# Altium project Smart Fan Controller.PrjPcb
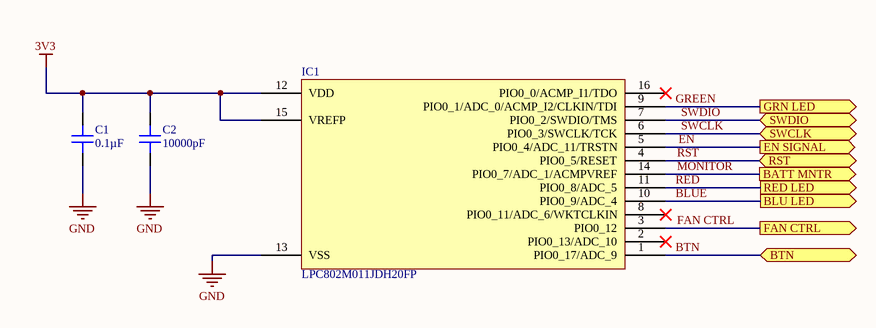
[diagram p0: SCH1_MCU.SchDoc]
5 sheets, 36 parts. Net scope: flat (ports and power ports of the same name join across sheets).
Board file: PCB_Smart_FAN_Controller_RevA.PcbDoc
Sheets:
  SCH1_MCU.SchDoc
  SCH2_Power.SchDoc
  SCH3_Fan_Control.SchDoc
  SCH4_RGB_Indicator.SchDoc
  SCH5_Misc.SchDoc

## Sheet SCH1_MCU.SchDoc: Airsoft FAN Controller
size A4

### Parts
C1  0.1µF  [CAP 0402_1005]
C2  10000pF  [CAP 0402_1005]
IC1  LPC802M011JDH20FP  [NXP TSSOP-16]

### Ports
BATT MNTR (out), BLU LED (out), BTN (bidir), EN SIGNAL (out), FAN CTRL (out), GRN LED (out), RED LED (out), RST (bidir), SWCLK (bidir), SWDIO (bidir)

### Nets
3V3: C1.2 C2.2 IC1.12(VDD) IC1.15(VREFP)
GND: C1.1 C2.1 IC1.13(VSS)
BLUE: IC1.10(PIO0_9/ADC_4) ; port BLU LED
BTN: IC1.1(PIO0_17/ADC_9) ; port BTN
EN: IC1.5(PIO0_4/ADC_11/TRSTN) ; port EN SIGNAL
FAN CTRL: IC1.3(PIO0_12) ; port FAN CTRL
GREEN: IC1.9(PIO0_1/ADC_0/ACMP_I2/CLKIN/TDI) ; port GRN LED
MONITOR: IC1.14(PIO0_7/ADC_1/ACMPVREF) ; port BATT MNTR
RED: IC1.11(PIO0_8/ADC_5) ; port RED LED
RST: IC1.4(PIO0_5/RESET) ; port RST
SWCLK: IC1.6(PIO0_3/SWCLK/TCK) ; port SWCLK
SWDIO: IC1.7(PIO0_2/SWDIO/TMS) ; port SWDIO

Not connected (* = marked no-connect by the designer): IC1 2(PIO0_13/ADC_10)* 8(PIO0_11/ADC_6/WKTCLKIN)* 16(PIO0_0/ACMP_I1/TDO)*

### Notes on the sheet
- Title
- Size:
- Date:
- A4
- Number:
- Time:
- Revision:
- Sheet
- of
- File:

### Library data of the parts
C1 = CC0402KRX5R8BB104: CAP CER 0.1UF 25V X5R 0402; Manufacturer: Yageo; Tolerance: ±10%; Part Number: CC0402KRX5R8BB104; Value: 0.1µF; Applications: General Purpose; Capacitance: 0.1µF; ComponentLink1Description: Datasheet; ComponentLink1URL: https://www.yageo.com/upload/media/product/productsearch/datasheet/mlcc/UPY-GPHC_X5R_4V-to-50V_25.pdf; ComponentLink2Description: DigiKey Link; ComponentLink2URL: http://digikey.com/product-detail/en/yageo/CC0402KRX5R8BB104/311-1697-1-ND/5195599; Device Package: 0402 (1005 Metric); LastUpdated: 9/2/2020 1:01:34 AM; Lifecycle Status: Active; Minimum Order: 1; Mounting Type: Surface Mount, MLCC; Operating Temperature: -55°C ~ 85°C; Package / Case: 0402 (1005 Metric); Packaging: TapeAndReel; PartId: 12727; Part Status: Active; Price: 0.01; Series: CC; Size / Dimension: 0.039" L x 0.020" W (1.00mm x 0.50mm); Supplier 1: DigiKey; Supplier Part Number 1: 311-1697-1-ND; Temperature Coefficient: X5R; Thickness (Max): 0.022" (0.55mm); Voltage - Rated: 25V
C2 = CGA2B2X5R1E103M050BA: CAP CER 10000PF 25V X5R 0402; Manufacturer: TDK Corporation; Tolerance: ±20%; Part Number: CGA2B2X5R1E103M050BA; Value: 10000pF; Applications: Automotive; Capacitance: 10000pF; ComponentLink1Description: Datasheet; ComponentLink1URL: https://product.tdk.com/info/en/catalog/datasheets/mlcc_automotive_general_en.pdf?ref_disty=digikey; ComponentLink2Description: DigiKey Link; ComponentLink2URL: http://digikey.com/product-detail/en/tdk-corporation/CGA2B2X5R1E103M050BA/445-12174-1-ND/3953840; Device Package: 0402 (1005 Metric); LastUpdated: 9/2/2020 1:02:10 AM; Lifecycle Status: Active; Minimum Order: 1; Mounting Type: Surface Mount, MLCC; Operating Temperature: -55°C ~ 85°C; Package / Case: 0402 (1005 Metric); Packaging: TapeAndReel; PartId: 8092; Part Status: Active; Price: 0.01; Ratings: AEC-Q200; Series: CGA; Size / Dimension: 0.039" L x 0.020" W (1.00mm x 0.50mm); Supplier 1: DigiKey; Supplier Part Number 1: 445-12174-1-ND; Temperature Coefficient: X5R; Thickness (Max): 0.022" (0.55mm); Voltage - Rated: 25V
IC1 = NXP LPC802 16PIN: Integrated CIrcuit; Price: 1.45

## Sheet SCH2_Power.SchDoc: Airsoft FAN Controller
size A4
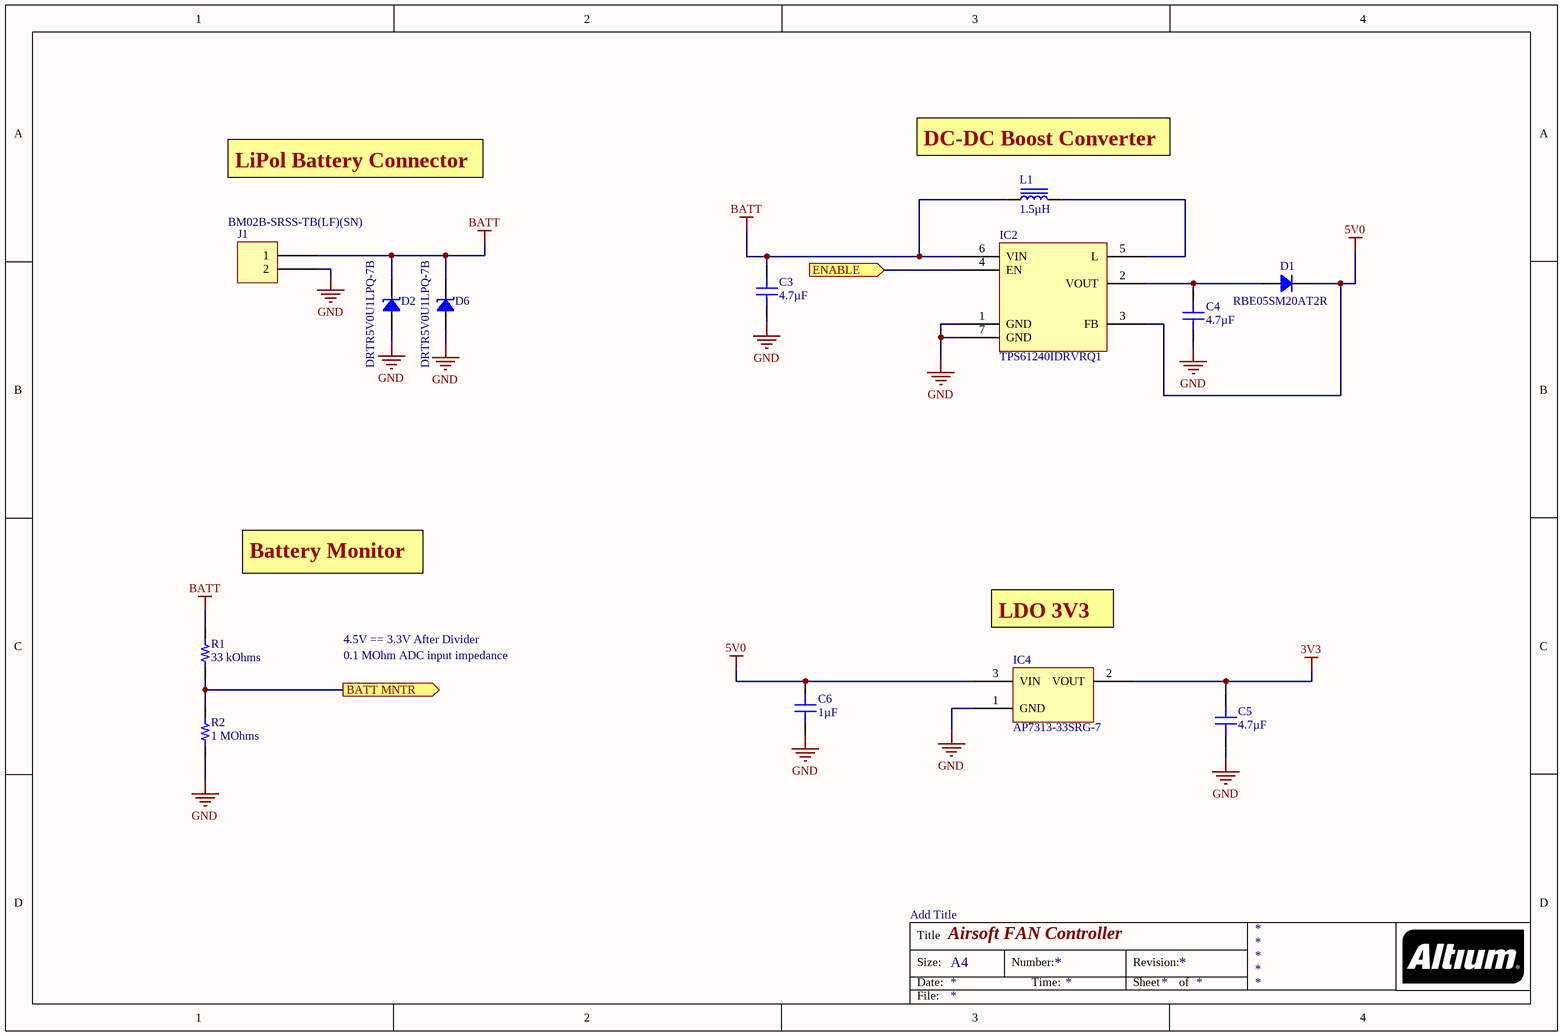
[diagram p1: SCH2_Power.SchDoc]

### Parts
C3  4.7µF  [CAP 0402_1005]
C4  4.7µF  [CAP 0402_1005]
C5  4.7µF  [CAP 0402_1005]
C6  1µF  [CAP 0402_1005]
D1  RBE05SM20AT2R  [SOD-523]
D2  DRTR5V0U1LPQ-7B  [0402]
D6  DRTR5V0U1LPQ-7B  [0402]
IC2  TPS61240IDRVRQ1  [TI WSON-6 DRV0006D 2x2MM]
IC4  AP7313-33SRG-7  [DIODES SOT-23-3]
J1  BM02B-SRSS-TB(LF)(SN)  [MOLX-53398-0271_V]
L1  1.5µH  [IND 0806_2016]
R1  33 kOhms  [RES 0402_1005]
R2  1 MOhms  [RES 0402_1005]

### Ports
BATT MNTR (out), ENABLE (in)

### Nets
3V3: C5.2 IC4.2(VOUT)
5V0: C6.2 D1.2 IC2.3(FB) IC4.3(VIN)
BATT: C3.2 D2.2 D6.2 IC2.6(VIN) J1.1 L1.1 R1.2
GND: C3.1 C4.1 C5.1 C6.1 D2.1 D6.1 IC2.1(GND) IC2.7(GND) IC4.1(GND) J1.2 R2.1
MONITOR: R1.1 R2.2 ; port BATT MNTR
NetC4_2: C4.2 D1.1 IC2.2(VOUT)
NetC7_2: IC2.4(EN) ; port ENABLE
NetIC2_5: IC2.5(L) L1.2

### Notes on the sheet
- LiPol Battery Connector
- (near L1) DC-DC Boost Converter 5V0
- Battery Monitor
- 4.5V == 3.3V After Divider
- LDO 3V3
- 0.1 MOhm ADC input impedance
- Add Title
- Title
- Size:
- Date:
- A4
- Number:
- Time:
- Revision:
- Sheet
- of
- File:

### Library data of the parts
C3-C5 = C1005X5R1A475K050BC: CAP CER 4.7UF 10V X5R 0402; Manufacturer: TDK Corporation; Tolerance: ±10%; Part Number: C1005X5R1A475K050BC; Value: 4.7µF; Applications: General Purpose; Capacitance: 4.7µF; ComponentLink1Description: Datasheet; ComponentLink1URL: https://product.tdk.com/info/en/catalog/datasheets/mlcc_commercial_general_en.pdf?ref_disty=digikey; ComponentLink2Description: DigiKey Link; ComponentLink2URL: http://digikey.com/product-detail/en/tdk-corporation/C1005X5R1A475K050BC/445-13820-1-ND/3955486; Device Package: 0402 (1005 Metric); Features: Low ESL; LastUpdated: 9/2/2020 1:02:25 AM; Lifecycle Status: Active; Minimum Order: 1; Mounting Type: Surface Mount, MLCC; Operating Temperature: -55°C ~ 85°C; Package / Case: 0402 (1005 Metric); Packaging: TapeAndReel; PartId: 1759; Part Status: Active; Price: 0.10; Series: C; Size / Dimension: 0.039" L x 0.020" W (1.00mm x 0.50mm); Supplier 1: DigiKey; Supplier Part Number 1: 445-13820-1-ND; Temperature Coefficient: X5R; Thickness (Max): 0.022" (0.55mm); Voltage - Rated: 10V
C6 = JMK105C6105KV-F: CAP CER 1UF 6.3V X6S 0402; Manufacturer: Taiyo Yuden; Tolerance: ±10%; Part Number: JMK105C6105KV-F; Value: 1µF; Applications: General Purpose; Capacitance: 1µF; ComponentLink1Description: Datasheet; ComponentLink1URL: https://www.yuden.co.jp/productdata/catalog/mlcc01_e.pdf; ComponentLink2Description: DigiKey Link; ComponentLink2URL: http://digikey.com/product-detail/en/taiyo-yuden/JMK105C6105KV-F/587-3381-1-ND/4157200; Device Package: 0402 (1005 Metric); LastUpdated: 9/2/2020 1:01:39 AM; Lifecycle Status: Active; Minimum Order: 1; Mounting Type: Surface Mount, MLCC; Operating Temperature: -55°C ~ 105°C; Package / Case: 0402 (1005 Metric); Packaging: TapeAndReel; PartId: 12563; Part Status: Active; Price: 0.01; Series: M; Size / Dimension: 0.039" L x 0.020" W (1.00mm x 0.50mm); Supplier 1: DigiKey; Supplier Part Number 1: 587-3381-1-ND; Temperature Coefficient: X6S; Thickness (Max): 0.022" (0.55mm); Voltage - Rated: 6.3V
D1 = RBE05SM20AT2R: DIODE SCHOTTKY 20V 500MA EMD2; Manufacturer: Rohm Semiconductor; Current - Reverse Leakage @ Vr: 150µA @ 20V; Speed: Fast Recovery =< 500ns, > 200mA (Io); Voltage - Forward (Vf) (Max) @ If: 530mV @ 500mA; Part Number: RBE05SM20AT2R; ComponentLink1Description: Datasheet; ComponentLink1URL: https://www.rohm.com/datasheet/RBE05SM20A/rbe05sm20at2r-e; ComponentLink2Description: DigiKey Link; ComponentLink2URL: http://digikey.com/product-detail/en/rohm-semiconductor/RBE05SM20AT2R/RBE05SM20AT2RTR-ND/5721257; Current - Average Rectified (Io): 500mA; Diode Type: Schottky; LastUpdated: 9/2/2020 1:23:19 AM; Lifecycle Status: Active; Minimum Order: 0; Mounting Type: Surface Mount; Operating Temperature - Junction: 150°C (Max); Package / Case: SC-79, SOD-523; Packaging: TapeAndReel; PartId: 2802; Part Status: Active; Price: 0.05; Series: -; Supplier 1: DigiKey; Supplier Part Number 1: RBE05SM20AT2RTR-ND; Supplier Device Package: EMD2; Voltage - DC Reverse (Vr) (Max): 20V
D2 D6 = DRTR5V0U1LPQ-7B: DATALINE PROTECT PP X1-DFN1006-2; Manufacturer: Diodes Incorporated; Capacitance @ Frequency: 1pF @ 1MHz; Current - Peak Pulse (10/1000µs): 5A (8/20µs); Power Line Protection: No; Type: Zener; Unidirectional Channels: 1; Voltage - Breakdown (Min): 6V; Voltage - Clamping (Max) @ Ipp: 10V; Voltage - Reverse Standoff (Typ): 5.5V (Max); Part Number: DRTR5V0U1LPQ-7B; Applications: Automotive; ComponentLink1Description: Datasheet; ComponentLink1URL: https://www.diodes.com/assets/Datasheets/DRTR5V0U1LPQ.pdf; ComponentLink2Description: DigiKey Link; ComponentLink2URL: http://digikey.com/product-detail/en/diodes-incorporated/DRTR5V0U1LPQ-7B/31-DRTR5V0U1LPQ-7BCT-ND/10674185; Device Package: 0402 (1006 Metric); LastUpdated: 9/2/2020 1:28:45 AM; Lifecycle Status: Active; Minimum Order: 1; Mounting Type: Surface Mount; Operating Temperature: -55°C ~ 150°C (TJ); Package / Case: 0402 (1006 Metric); Packaging: Unknown; PartId: 10375; Part Status: Active; Price: 0.04; Series: Automotive, AEC-Q101; Supplier 1: DigiKey; Supplier Part Number 1: 31-DRTR5V0U1LPQ-7BCT-ND; Supplier Device Package: X1-DFN1006-2
IC2 = TPS61240IDRVRQ1: IC REG BOOST 5V 500MA 6SON; Manufacturer: Texas Instruments; Current - Output: 500mA (Switch); Frequency - Switching: 3.5MHz; Function: Step-Up; Number of Outputs: 1; Output Configuration: Positive; Output Type: Fixed; Synchronous Rectifier: Yes; Voltage - Input (Max): 5.5V; Voltage - Input (Min): 2.3V; Part Number: TPS61240IDRVRQ1; ComponentLink1Description: Datasheet; ComponentLink1URL: http://www.ti.com/general/docs/suppproductinfo.tsp?distId=10&gotoUrl=http%3A%2F%2Fwww.ti.com%2Flit%2Fgpn%2Ftps61240-q1; ComponentLink2Description: DigiKey Link; ComponentLink2URL: http://digikey.com/product-detail/en/texas-instruments/TPS61240IDRVRQ1/296-28184-1-ND/2522312; LastUpdated: 9/13/2020 11:04:11 AM; Lifecycle Status: Active; Minimum Order: 1; Mounting Type: Surface Mount; Operating Temperature: -40°C ~ 85°C (TA); Package / Case: 6-WDFN Exposed Pad; Packaging: TapeAndReel; Part Status: Active; Price: 0.73; Series: Automotive, AEC-Q100; Supplier 1: DigiKey; Supplier Part Number 1: 296-28184-1-ND; Supplier Device Package: 6-SON (2x2); Topology: Boost; Voltage - Output (Min/Fixed): 5V
IC4 = AP7313-33SRG-7: IC REG LIN 3.3V 150MA SOT23R-3; Manufacturer: Diodes Incorporated; Current - Quiescent (Iq): 75µA; Current - Supply (Max): 85µA; Number of Regulators: 1; Output Configuration: Positive; Output Type: Fixed; Protection Features: Over Current, Over Temperature, Short Circuit; PSRR: 65dB (100Hz); Voltage Dropout (Max): 0.3V @ 150mA; Voltage - Input (Max): 6V; Part Number: AP7313-33SRG-7; ComponentLink1Description: Datasheet; ComponentLink1URL: https://www.diodes.com/assets/Datasheets/AP7313.pdf; ComponentLink2Description: DigiKey Link; ComponentLink2URL: http://digikey.com/product-detail/en/diodes-incorporated/AP7313-33SRG-7/AP7313-33SRG-7DICT-ND/2270841; Current - Output: 150mA; LastUpdated: 9/2/2020 1:24:50 AM; Lifecycle Status: Active; Minimum Order: 1; Mounting Type: Surface Mount; Operating Temperature: -40°C ~ 85°C; Package / Case: TO-236-3, SC-59, SOT-23-3; Packaging: TapeAndReel; Part Status: Active; Price: 0.09; Series: -; Supplier 1: DigiKey; Supplier Part Number 1: AP7313-33SRG-7DICT-ND; Supplier Device Package: SOT-23R-3; Voltage - Output (Min/Fixed): 3.3V
J1 = BM02B-SRSS-TB(LF)(SN): CONN HEADER SMD 2POS 1MM; Manufacturer: JST Sales America Inc.; Current Rating (Amps): 0.7A; Material Flammability Rating: UL94 V-0; Number of Positions: 2; Number of Positions Loaded: All; Pitch - Mating: 0.039" (1.00mm); Shrouding: Shrouded - 4 Wall; Style: Board to Cable/Wire; Voltage Rating: 50V; Part Number: BM02B-SRSS-TB(LF)(SN); ComponentLink1Description: Datasheet; ComponentLink1URL: http://www.jst-mfg.com/product/pdf/eng/eSR.pdf; ComponentLink2Description: DigiKey Link; ComponentLink2URL: http://digikey.com/product-detail/en/jst-sales-america-inc/BM02B-SRSS-TB-LF-SN/455-1788-1-ND/926859; Connector Type: Header; Contact Finish - Mating: Tin; Contact Finish - Post: Tin; Contact Material: Copper Alloy; Contact Shape: Square; Contact Type: Male Pin; Fastening Type: Push-Pull; Features: Solder Retention; Insulation Color: Natural; Insulation Height: 0.167" (4.25mm); Insulation Material: Polyamide (PA), Nylon; LastUpdated: 1/12/2020 10:11:04 PM; Lifecycle Status: Active; Minimum Order: 1; Mounting Type: Surface Mount; Number of Rows: 1; Operating Temperature: -25°C ~ 85°C; Packaging: TapeAndReel; PartId: 12; Part Status: Active; Price: 0.22; Series: SR; Supplier 1: DigiKey; Supplier Part Number 1: 455-1788-1-ND; Termination: Solder
L1 = LQH2MCN1R5M52L: FIXED IND 1.5UH 540MA 330 MOHM; Manufacturer: Murata Electronics; DC Resistance (DCR): 429mOhm Max; Frequency - Self Resonant: 165MHz; Inductance Frequency - Test: 1MHz; Material - Core: Ferrite; Shielding: Unshielded; Tolerance: ±20%; Type: Wirewound; Part Number: LQH2MCN1R5M52L; ComponentLink1Description: Datasheet; ComponentLink1URL: https://search.murata.co.jp/Ceramy/image/img/P02/JELF243A-0060.pdf; ComponentLink2Description: DigiKey Link; ComponentLink2URL: http://digikey.com/product-detail/en/murata-electronics/LQH2MCN1R5M52L/490-4985-1-ND/1788283; Current Rating (Amps): 540mA; Device Package: 0806 (2016 Metric); Height - Seated (Max): 0.037" (0.95mm); Inductance: 1.5µH; LastUpdated: 9/2/2020 1:24:34 AM; Lifecycle Status: Active; Minimum Order: 1; Mounting Type: Surface Mount; Operating Temperature: -40°C ~ 85°C; Package / Case: 0806 (2016 Metric); Packaging: TapeAndReel; PartId: 3084; Part Status: Active; Price: 0.14; Series: LQH2; Size / Dimension: 0.079" L x 0.063" W (2.00mm x 1.60mm); Supplier 1: DigiKey; Supplier Part Number 1: 490-4985-1-ND; Supplier Device Package: 0806 (2016 Metric); Value: 1.5µH
R1 = RR0510P-333-D: RES SMD 33K OHM 0.5% 1/16W 0402; Manufacturer: Susumu; Power (Watts): 0.063W, 1/16W; Temperature Coefficient: ±25ppm/°C; Part Number: RR0510P-333-D; Value: 33 kOhms; ComponentLink1Description: Datasheet; ComponentLink1URL: http://www.susumu.co.jp/common/pdf/n_catalog_partition05_en.pdf; ComponentLink2Description: DigiKey Link; ComponentLink2URL: http://digikey.com/product-detail/en/susumu/RR0510P-333-D/RR05P33.0KDCT-ND/432971; Composition: Thin Film; Device Package: 0402 (1005 Metric); Height - Seated (Max): 0.016" (0.40mm); LastUpdated: 9/2/2020 1:08:09 AM; Lifecycle Status: Active; Minimum Order: 1; Number of Terminations: 2; Operating Temperature: -55°C ~ 125°C; Package / Case: 0402 (1005 Metric); Packaging: TapeAndReel; PartId: 3295; Part Status: Active; Price: 0.01; Resistance: 33 kOhms; Series: RR; Size / Dimension: 0.039" L x 0.020" W (1.00mm x 0.50mm); Supplier 1: DigiKey; Supplier Part Number 1: RR05P33.0KDCT-ND; Tolerance: ±0.5%
R2 = CRCW04021M00FKTD: RES SMD 1M OHM 1% 1/16W 0402; Manufacturer: Vishay Dale; Power (Watts): 0.063W, 1/16W; Temperature Coefficient: ±100ppm/°C; Part Number: CRCW04021M00FKTD; Value: 1 MOhms; ComponentLink1Description: Datasheet; ComponentLink1URL: http://www.vishay.com/docs/20008/dcrcw.pdf; ComponentLink2Description: DigiKey Link; ComponentLink2URL: http://digikey.com/product-detail/en/vishay-dale/CRCW04021M00FKTD/541-CRCW04021M00FKTDCT-ND/11500836; Composition: Thick Film; Device Package: 0402 (1005 Metric); Features: Automotive AEC-Q200; LastUpdated: 9/2/2020 1:07:22 AM; Lifecycle Status: Active; Minimum Order: 1; Number of Terminations: 2; Operating Temperature: -55°C ~ 155°C; Package / Case: 0402 (1005 Metric); Packaging: TapeAndReel; PartId: 56877; Price: 0.01; Ratings: AEC-Q200; Resistance: 1 MOhms; Series: CRCW; Supplier 1: DigiKey; Supplier Part Number 1: 541-CRCW04021M00FKTDCT-ND; Supplier Device Package: 0402; Tolerance: ±1%

## Sheet SCH3_Fan_Control.SchDoc: Airsoft FAN Controller
size A4
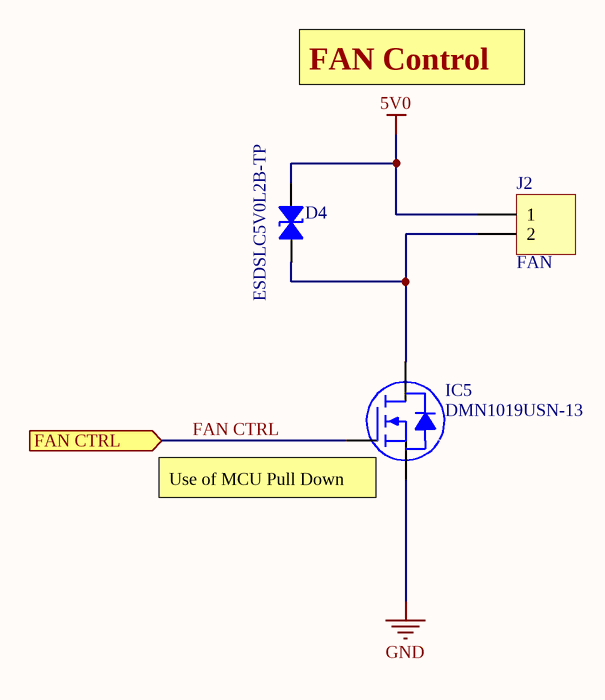
[diagram p2: SCH3_Fan_Control.SchDoc]

### Parts
D4  ESDSLC5V0L2B-TP  [0402]
IC5  DMN1019USN-13  [DIODES SOT-23-3]
J2  FAN  [FAN Connections]

### Ports
FAN CTRL (in)

### Nets
5V0: D4.2 J2.1
GND: IC5.2(S)
FAN CTRL: IC5.1(G) ; port FAN CTRL
NetD4_1: D4.1 IC5.3(D) J2.2

### Notes on the sheet
- FAN Control
- (near IC5) Use of MCU Pull Down
- Title
- Size:
- Date:
- A4
- Number:
- Time:
- Revision:
- Sheet
- of
- File:

### Library data of the parts
D4 = ESDSLC5V0L2B-TP: 5.5V, ESD PROTECTION DEVICES, DF; Manufacturer: Micro Commercial Co; Bidirectional Channels: 1; Capacitance @ Frequency: 0.15pF @ 1MHz; Current - Peak Pulse (10/1000µs): 3A (8/20µs); Power Line Protection: No; Power - Peak Pulse: 40W; Type: Zener; Voltage - Breakdown (Min): 6.5V; Voltage - Clamping (Max) @ Ipp: 15V; Voltage - Reverse Standoff (Typ): 5.5V (Max); Part Number: ESDSLC5V0L2B-TP; Applications: General Purpose; ComponentLink1Description: Datasheet; ComponentLink1URL: https://mccsemi.com/pdf/Products/ESDSLC5V0L2B(DFN1006-2L)-V1.pdf; ComponentLink2Description: DigiKey Link; ComponentLink2URL: http://digikey.com/product-detail/en/micro-commercial-co/ESDSLC5V0L2B-TP/353-ESDSLC5V0L2B-TPCT-ND/12177299; LastUpdated: 8/30/2020 9:08:11 PM; Lifecycle Status: Active; Minimum Order: 1; Mounting Type: Surface Mount; Operating Temperature: -55°C ~ 150°C (TJ); Package / Case: 0402 (1006 Metric); Packaging: Unknown; PartId: 11464; Price: 0.03; Supplier 1: DigiKey; Supplier Part Number 1: 353-ESDSLC5V0L2B-TPCT-ND; Supplier Device Package: DFN1006-2L
IC5 = DMN1019USN-13: MOSFET N-CH 12V 9.3A SC59; Manufacturer: Diodes Incorporated; Current - Continuous Drain (Id) @ 25°C: 9.3A (Ta); Drive Voltage (Max Rds On,  Min Rds On): 1.2V, 2.5V; FET Type: N-Channel; Gate Charge (Qg) (Max) @ Vgs: 50.6nC @ 8V; Input Capacitance (Ciss) (Max) @ Vds: 2426pF @ 10V; Power Dissipation (Max): 680mW (Ta); Rds On (Max) @ Id, Vgs: 10mOhm @ 9.7A, 4.5V; Vgs (Max): ±8V; Vgs(th) (Max) @ Id: 800mV @ 250µA; Part Number: DMN1019USN-13; ComponentLink1Description: Datasheet; ComponentLink1URL: https://www.diodes.com/assets/Datasheets/DMN1019USN.pdf; ComponentLink2Description: DigiKey Link; ComponentLink2URL: http://digikey.com/product-detail/en/diodes-incorporated/DMN1019USN-13/DMN1019USN-13DICT-ND/4898885; Drain to Source Voltage (Vdss): 12V; LastUpdated: 9/2/2020 1:25:02 AM; Lifecycle Status: Active; Minimum Order: 1; Mounting Type: Surface Mount; Operating Temperature: -55°C ~ 150°C (TJ); Package / Case: TO-236-3, SC-59, SOT-23-3; Packaging: TapeAndReel; Part Status: Active; Price: 0.10; Series: -; Supplier 1: DigiKey; Supplier Part Number 1: DMN1019USN-13DICT-ND; Supplier Device Package: SC-59; Technology: MOSFET (Metal Oxide)
J2 = FAN Connection: Fan Connection Test Points; LatestRevisionDate: 17-Jul-2002; LatestRevisionNote: Re-released for DXP Platform.; Publisher: Altium Limited

## Sheet SCH4_RGB_Indicator.SchDoc: Airsoft FAN Controller
size A4
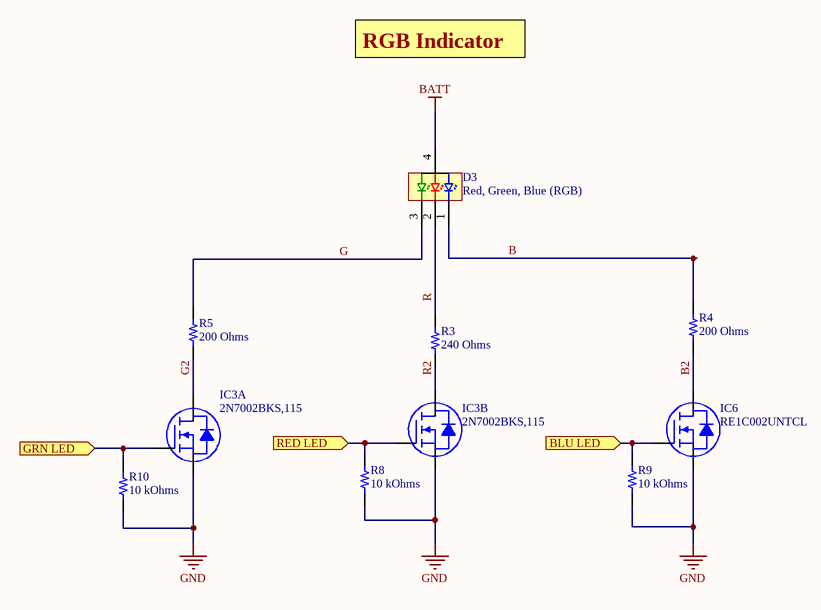
[diagram p3: SCH4_RGB_Indicator.SchDoc]

### Parts
D3  Red, Green, Blue (RGB)  [Citizen CL-505S-X-SD-T]
IC3  2N7002BKS,115  [NXP SOT-363]  (parts A,B of 2)
IC6  RE1C002UNTCL  [ROHM SC-89-SOT-490]
R3  240 Ohms  [RES 0402_1005]
R4  200 Ohms  [RES 0402_1005]
R5  200 Ohms  [RES 0402_1005]
R8  10 kOhms  [RES 0402_1005]
R9  10 kOhms  [RES 0402_1005]
R10  10 kOhms  [RES 0402_1005]

### Ports
BLU LED (in), GRN LED (in), RED LED (in)

### Nets
BATT: D3.4(A3)
GND: IC3.1(S1) IC3.4(S2) IC6.2(S) R8.1 R9.1 R10.1
B2: IC6.3(D) R4.1
BLUE: IC6.1(G) R9.2 ; port BLU LED
G: D3.3(C3) R5.2
G2: IC3.6(D1) R5.1
GREEN: IC3.2(G1) R10.2 ; port GRN LED
R: D3.2(C2) R3.2
R2: IC3.3(D2) R3.1
RED: IC3.5(G2) R8.2 ; port RED LED
NetD3_1: D3.1(C1) R4.2

### Notes on the sheet
- RGB Indicator
- Title
- Size:
- Date:
- A4
- Number:
- Time:
- Revision:
- Sheet
- of
- File:
- Labels drawn without touching a wire or pin: B

### Library data of the parts
D3 = CL-505S-X-SD-T: LED TRI TOP FIRING 1.0 X 1.0; Manufacturer: Citizen; Configuration: Common Anode; Current - Test: 5mA Red, 5mA Green, 5mA Blue; Lens Color: 0.26mm; Lens Size: 1.00mm; Lens Style: Square with Flat Top; Millicandela Rating: 40mcd Red, 220mcd Green, 65mcd Blue; Voltage - Forward (Vf) (Typ): 1.85V Red, 2.7V Green, 2.75V Blue; Wavelength - Dominant: 615nm Red, 530nm Green, 470nm Blue; Part Number: CL-505S-X-SD-T; Color: Red, Green, Blue (RGB); ComponentLink1Description: Datasheet; ComponentLink1URL: http://ce.citizen.co.jp/up_img/product/sQNrj4RlM7o2/CL-505S_e.pdf; ComponentLink2Description: DigiKey Link; ComponentLink2URL: http://digikey.com/product-detail/en/citizen/CL-505S-X-SD-T/1642-1510-1-ND/6005950; Device Package: 0404 (1010 Metric); Height (Max): 0.26mm; LastUpdated: 3/19/2020 10:25:23 PM; Lifecycle Status: Active; Minimum Order: 1; Mounting Type: Surface Mount; Package / Case: 0404 (1010 Metric); Packaging: TapeAndReel; PartId: 955; Part Status: Active; Price: 0.23; Series: CL-505S; Size / Dimension: 1.00mm L x 1.00mm W; Supplier 1: DigiKey; Supplier Part Number 1: 1642-1510-1-ND; Value: Red, Green, Blue (RGB)
IC3 = 2N7002BKS,115: MOSFET 2N-CH 60V 0.3A 6TSSOP; Manufacturer: Nexperia USA Inc.; Current - Continuous Drain (Id) @ 25°C: 300mA; FET Feature: Logic Level Gate; FET Type: 2 N-Channel (Dual); Gate Charge (Qg) (Max) @ Vgs: 0.6nC @ 4.5V; Input Capacitance (Ciss) (Max) @ Vds: 50pF @ 10V; Power - Max: 295mW; Rds On (Max) @ Id, Vgs: 1.6Ohm @ 500mA, 10V; Vgs(th) (Max) @ Id: 2.1V @ 250µA; Part Number: 2N7002BKS,115; ComponentLink1Description: Datasheet; ComponentLink1URL: https://assets.nexperia.com/documents/data-sheet/2N7002BKS.pdf; ComponentLink2Description: DigiKey Link; ComponentLink2URL: http://digikey.com/product-detail/en/nexperia-usa-inc/2N7002BKS115/1727-4786-1-ND/2531264; Drain to Source Voltage (Vdss): 60V; LastUpdated: 9/2/2020 1:29:59 AM; Lifecycle Status: Active; Minimum Order: 1; Mounting Type: Surface Mount; Operating Temperature: 150°C (TJ); Package / Case: 6-TSSOP, SC-88, SOT-363; Packaging: TapeAndReel; Part Status: Active; Price: 0.08; Series: Automotive, AEC-Q101, TrenchMOS™; Supplier 1: DigiKey; Supplier Part Number 1: 1727-4786-1-ND; Supplier Device Package: 6-TSSOP
IC6 = RE1C002UNTCL: MOSFET N-CH 20V 0.2A EMT3; Manufacturer: Rohm Semiconductor; Current - Continuous Drain (Id) @ 25°C: 200mA (Ta); Drive Voltage (Max Rds On,  Min Rds On): 1.2V, 2.5V; FET Type: N-Channel; Input Capacitance (Ciss) (Max) @ Vds: 25pF @ 10V; Power Dissipation (Max): 150mW (Ta); Rds On (Max) @ Id, Vgs: 1.2Ohm @ 100mA, 2.5V; Vgs (Max): ±8V; Vgs(th) (Max) @ Id: 1V @ 1mA; Part Number: RE1C002UNTCL; ComponentLink1Description: Datasheet; ComponentLink1URL: https://www.rohm.com/datasheet/RE1C002UN/re1c002untcl-e; ComponentLink2Description: DigiKey Link; ComponentLink2URL: http://digikey.com/product-detail/en/rohm-semiconductor/RE1C002UNTCL/RE1C002UNTCLCT-ND/5042535; Drain to Source Voltage (Vdss): 20V; LastUpdated: 9/2/2020 1:30:13 AM; Lifecycle Status: Active; Minimum Order: 1; Mounting Type: Surface Mount; Operating Temperature: 150°C (TJ); Package / Case: SC-89, SOT-490; Packaging: TapeAndReel; Part Status: Active; Price: 0.03; Series: -; Supplier 1: DigiKey; Supplier Part Number 1: RE1C002UNTCLCT-ND; Supplier Device Package: EMT3F (SOT-416FL); Technology: MOSFET (Metal Oxide)
R3 = RR0510P-241-D: RES SMD 240 OHM 0.5% 1/16W 0402; Manufacturer: Susumu; Power (Watts): 0.063W, 1/16W; Temperature Coefficient: ±25ppm/°C; Part Number: RR0510P-241-D; Value: 240 Ohms; ComponentLink1Description: Datasheet; ComponentLink1URL: http://www.susumu.co.jp/common/pdf/n_catalog_partition05_en.pdf; ComponentLink2Description: DigiKey Link; ComponentLink2URL: http://digikey.com/product-detail/en/susumu/RR0510P-241-D/RR05P240DCT-ND/432922; Composition: Thin Film; Device Package: 0402 (1005 Metric); Height - Seated (Max): 0.016" (0.40mm); LastUpdated: 9/2/2020 1:08:09 AM; Lifecycle Status: Active; Minimum Order: 1; Number of Terminations: 2; Operating Temperature: -55°C ~ 125°C; Package / Case: 0402 (1005 Metric); Packaging: TapeAndReel; PartId: 3287; Part Status: Active; Price: 0.01; Resistance: 240 Ohms; Series: RR; Size / Dimension: 0.039" L x 0.020" W (1.00mm x 0.50mm); Supplier 1: DigiKey; Supplier Part Number 1: RR05P240DCT-ND; Tolerance: ±0.5%
R4 R5 = RR0510P-201-D: RES SMD 200 OHM 0.5% 1/16W 0402; Manufacturer: Susumu; Power (Watts): 0.063W, 1/16W; Temperature Coefficient: ±25ppm/°C; Part Number: RR0510P-201-D; Value: 200 Ohms; ComponentLink1Description: Datasheet; ComponentLink1URL: http://www.susumu.co.jp/common/pdf/n_catalog_partition05_en.pdf; ComponentLink2Description: DigiKey Link; ComponentLink2URL: http://digikey.com/product-detail/en/susumu/RR0510P-201-D/RR05P200DCT-ND/432920; Composition: Thin Film; Device Package: 0402 (1005 Metric); Height - Seated (Max): 0.016" (0.40mm); LastUpdated: 9/2/2020 1:08:09 AM; Lifecycle Status: Active; Minimum Order: 1; Number of Terminations: 2; Operating Temperature: -55°C ~ 125°C; Package / Case: 0402 (1005 Metric); Packaging: TapeAndReel; PartId: 3269; Part Status: Active; Price: 0.01; Resistance: 200 Ohms; Series: RR; Size / Dimension: 0.039" L x 0.020" W (1.00mm x 0.50mm); Supplier 1: DigiKey; Supplier Part Number 1: RR05P200DCT-ND; Tolerance: ±0.5%
R8-R10 = ASC0402-10KF1: RES 10 KOHM 1% 1/16W 0402; Manufacturer: Riedon; Power (Watts): 0.063W, 1/16W; Temperature Coefficient: ±100ppm/°C; Part Number: ASC0402-10KF1; Value: 10 kOhms; ComponentLink1Description: Datasheet; ComponentLink1URL: https://riedon.com/media/pdf/ASC.pdf; ComponentLink2Description: DigiKey Link; ComponentLink2URL: http://digikey.com/product-detail/en/riedon/ASC0402-10KF1/696-1775-1-ND/7398745; Composition: Thick Film; Device Package: 0402 (1005 Metric); Features: Anti-Sulfur, Automotive AEC-Q200, Moisture Resistant; Height - Seated (Max): 0.016" (0.40mm); LastUpdated: 9/2/2020 1:07:48 AM; Lifecycle Status: Active; Minimum Order: 1; Number of Terminations: 2; Operating Temperature: -55°C ~ 155°C; Package / Case: 0402 (1005 Metric); Packaging: TapeAndReel; PartId: 12809; Part Status: Active; Price: 0.01; Ratings: AEC-Q200; Resistance: 10 kOhms; Series: ASC; Size / Dimension: 0.039" L x 0.020" W (1.00mm x 0.50mm); Supplier 1: DigiKey; Supplier Part Number 1: 696-1775-1-ND; Supplier Device Package: 0402; Tolerance: ±1%

## Sheet SCH5_Misc.SchDoc: Airsoft FAN Controller
size A4
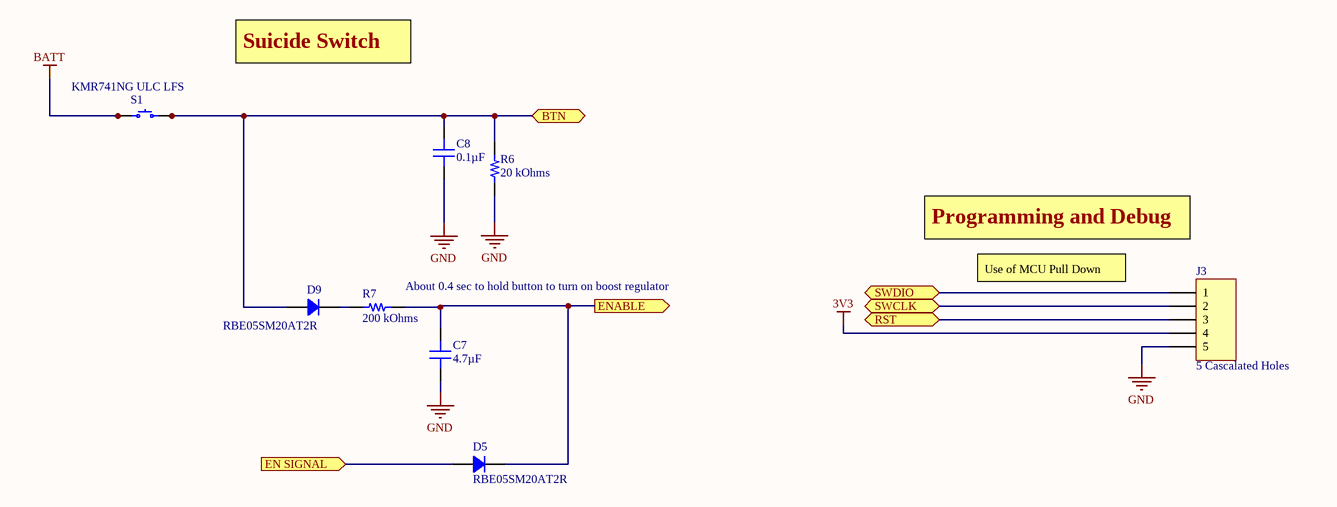
[diagram p4: SCH5_Misc.SchDoc]

### Parts
C7  4.7µF  [CAP 0402_1005]
C8  0.1µF  [CAP 0402_1005]
D5  RBE05SM20AT2R  [SOD-523]
D9  RBE05SM20AT2R  [SOD-523]
J3  5 Cascalated Holes  [Cascalated Holes]
R6  20 kOhms  [RES 0402_1005]
R7  200 kOhms  [RES 0402_1005]
S1  KMR741NG ULC LFS  [C&K KMR7]

### Ports
BTN (bidir), EN SIGNAL (in), ENABLE (out), RST (bidir), SWCLK (bidir), SWDIO (bidir)

### Nets
3V3: J3.4
BATT: S1.1 S1.2
GND: C7.1 C8.1 J3.5 R6.1
BTN: C8.2 D9.1 R6.2 S1.3 S1.4 ; port BTN
EN: D5.1 ; port EN SIGNAL
RST: J3.3 ; port RST
SWCLK: J3.2 ; port SWCLK
SWDIO: J3.1 ; port SWDIO
NetC7_2: C7.2 D5.2 R7.2 ; port ENABLE
NetD9_2: D9.2 R7.1

### Notes on the sheet
- Suicide Switch
- (near R7) About 0.4 sec to hold button to turn on boost regulator
- Programming and Debug
- Use of MCU Pull Down
- Title
- Size:
- Date:
- A4
- Number:
- Time:
- Revision:
- Sheet
- of
- File:

### Library data of the parts
C7 = C1005X5R1A475K050BC: as C3 on sheet SCH2_Power; Part Number: C1005X5R1A475K050BC; Value: 4.7µF; Applications: General Purpose; Capacitance: 4.7µF; ComponentLink1Description: Datasheet; ComponentLink1URL: https://product.tdk.com/info/en/catalog/datasheets/mlcc_commercial_general_en.pdf?ref_disty=digikey; ComponentLink2Description: DigiKey Link; ComponentLink2URL: http://digikey.com/product-detail/en/tdk-corporation/C1005X5R1A475K050BC/445-13820-1-ND/3955486; Device Package: 0402 (1005 Metric); Features: Low ESL; LastUpdated: 9/2/2020 1:02:25 AM; Lifecycle Status: Active; Minimum Order: 1; Mounting Type: Surface Mount, MLCC; Operating Temperature: -55°C ~ 85°C; Package / Case: 0402 (1005 Metric); Packaging: TapeAndReel; PartId: 1759; Part Status: Active; Price: 0.10; Series: C; Size / Dimension: 0.039" L x 0.020" W (1.00mm x 0.50mm); Supplier 1: DigiKey; Supplier Part Number 1: 445-13820-1-ND; Temperature Coefficient: X5R; Thickness (Max): 0.022" (0.55mm); Voltage - Rated: 10V
C8 = CC0402KRX5R8BB104: as C1 on sheet SCH1_MCU; Part Number: CC0402KRX5R8BB104; Value: 0.1µF; Applications: General Purpose; Capacitance: 0.1µF; ComponentLink1Description: Datasheet; ComponentLink1URL: https://www.yageo.com/upload/media/product/productsearch/datasheet/mlcc/UPY-GPHC_X5R_4V-to-50V_25.pdf; ComponentLink2Description: DigiKey Link; ComponentLink2URL: http://digikey.com/product-detail/en/yageo/CC0402KRX5R8BB104/311-1697-1-ND/5195599; Device Package: 0402 (1005 Metric); LastUpdated: 9/2/2020 1:01:34 AM; Lifecycle Status: Active; Minimum Order: 1; Mounting Type: Surface Mount, MLCC; Operating Temperature: -55°C ~ 85°C; Package / Case: 0402 (1005 Metric); Packaging: TapeAndReel; PartId: 12727; Part Status: Active; Price: 0.01; Series: CC; Size / Dimension: 0.039" L x 0.020" W (1.00mm x 0.50mm); Supplier 1: DigiKey; Supplier Part Number 1: 311-1697-1-ND; Temperature Coefficient: X5R; Thickness (Max): 0.022" (0.55mm); Voltage - Rated: 25V
D5 D9 = RBE05SM20AT2R: as D1 on sheet SCH2_Power; Part Number: RBE05SM20AT2R; ComponentLink1Description: Datasheet; ComponentLink1URL: https://www.rohm.com/datasheet/RBE05SM20A/rbe05sm20at2r-e; ComponentLink2Description: DigiKey Link; ComponentLink2URL: http://digikey.com/product-detail/en/rohm-semiconductor/RBE05SM20AT2R/RBE05SM20AT2RTR-ND/5721257; Current - Average Rectified (Io): 500mA; Diode Type: Schottky; LastUpdated: 9/2/2020 1:23:19 AM; Lifecycle Status: Active; Minimum Order: 0; Mounting Type: Surface Mount; Operating Temperature - Junction: 150°C (Max); Package / Case: SC-79, SOD-523; Packaging: TapeAndReel; PartId: 2802; Part Status: Active; Price: 0.05; Series: -; Supplier 1: DigiKey; Supplier Part Number 1: RBE05SM20AT2RTR-ND; Supplier Device Package: EMD2; Voltage - DC Reverse (Vr) (Max): 20V
J3 = Cascalated Holes: LatestRevisionDate: 17-Jul-2002; LatestRevisionNote: Re-released for DXP Platform.; Publisher: Altium Limited
R6 = RG1005P-203-D-T10: RES SMD 20K OHM 0.5% 1/16W 0402; Manufacturer: Susumu; Power (Watts): 0.063W, 1/16W; Temperature Coefficient: ±25ppm/°C; Part Number: RG1005P-203-D-T10; Value: 20 kOhms; ComponentLink1Description: Datasheet; ComponentLink1URL: http://www.susumu.co.jp/common/pdf/n_catalog_partition01_en.pdf; ComponentLink2Description: DigiKey Link; ComponentLink2URL: http://digikey.com/product-detail/en/susumu/RG1005P-203-D-T10/408-1674-1-ND/1288043; Composition: Thin Film; Device Package: 0402 (1005 Metric); Features: Anti-Sulfur, Automotive AEC-Q200; Height - Seated (Max): 0.016" (0.40mm); LastUpdated: 9/2/2020 1:07:34 AM; Lifecycle Status: Active; Minimum Order: 1; Number of Terminations: 2; Operating Temperature: -55°C ~ 155°C; Package / Case: 0402 (1005 Metric); Packaging: TapeAndReel; PartId: 18569; Part Status: Active; Price: 0.01; Ratings: AEC-Q200; Resistance: 20 kOhms; Series: RG; Size / Dimension: 0.039" L x 0.020" W (1.00mm x 0.50mm); Supplier 1: DigiKey; Supplier Part Number 1: 408-1674-1-ND; Supplier Device Package: 0402; Tolerance: ±0.5%
R7 = ERJ-PA2J204X: RES SMD 200 KOHM 5% 1/5W 0402; Manufacturer: Panasonic Electronic Components; Power (Watts): 0.2W, 1/5W; Temperature Coefficient: ±200ppm/°C; Part Number: ERJ-PA2J204X; Value: 200 kOhms; ComponentLink1Description: Datasheet; ComponentLink1URL: https://industrial.panasonic.com/cdbs/www-data/pdf/RDO0000/AOA0000C331.pdf; ComponentLink2Description: DigiKey Link; ComponentLink2URL: http://digikey.com/product-detail/en/panasonic-electronic-components/ERJ-PA2J204X/P124546CT-ND/10284816; Composition: Thick Film; Device Package: 0402 (1005 Metric); Features: Automotive AEC-Q200, Pulse Withstanding; Height - Seated (Max): 0.016" (0.40mm); LastUpdated: 9/2/2020 1:07:33 AM; Lifecycle Status: Active; Minimum Order: 1; Number of Terminations: 2; Operating Temperature: -55°C ~ 155°C; Package / Case: 0402 (1005 Metric); Packaging: TapeAndReel; PartId: 18890; Part Status: Active; Price: 0.01; Ratings: AEC-Q200; Resistance: 200 kOhms; Series: ERJ; Size / Dimension: 0.039" L x 0.022" W (1.00mm x 0.55mm); Supplier 1: DigiKey; Supplier Part Number 1: P124546CT-ND; Supplier Device Package: 0402; Tolerance: ±5%
S1 = KMR741NG ULC LFS: SWITCH TACTILE SPST-NO 50MA 32V; Manufacturer: C&K; Actuator Height off PCB, Vertical: 2.50mm; Actuator Orientation: Top Actuated; Actuator Type: Standard; Contact Rating @ Voltage: 0.05A @ 32VDC; Illumination: Non-Illuminated; Ingress Protection: IP67 - Dust Tight, Waterproof; Operating Force: 400gf; Outline: 4.20mm x 2.80mm; Switch Function: Off-Mom; Part Number: KMR741NG ULC LFS; Circuit: SPST-NO; ComponentLink1Description: Datasheet; ComponentLink1URL: https://dznh3ojzb2azq.cloudfront.net/products/Tactile/KMR7/documents/datasheet.pdf; ComponentLink2Description: DigiKey Link; ComponentLink2URL: http://digikey.com/product-detail/en/c-k/KMR741NG-ULC-LFS/CKN10688CT-ND/6035360; LastUpdated: 4/9/2020 10:01:05 AM; Lifecycle Status: Active; Minimum Order: 1; Mounting Type: Surface Mount; Operating Temperature: -40°C ~ 85°C; Packaging: TapeAndReel; Part Status: Active; Price: 0.16; Series: KMR7; Supplier 1: DigiKey; Supplier Part Number 1: CKN10688CT-ND; Termination Style: Gull Wing

## Nets that join several sheets
3V3: SCH1_MCU (C1.2 C2.2 IC1.12 IC1.15), SCH2_Power (C5.2 IC4.2), SCH5_Misc (J3.4)
5V0: SCH2_Power (C6.2 D1.2 IC2.3 IC4.3), SCH3_Fan_Control (D4.2 J2.1)
BATT: SCH2_Power (7 pins), SCH4_RGB_Indicator (D3.4), SCH5_Misc (S1.1 S1.2)
GND: SCH1_MCU (C1.1 C2.1 IC1.13), SCH2_Power (11 pins), SCH3_Fan_Control (IC5.2), SCH4_RGB_Indicator (6 pins), SCH5_Misc (C7.1 C8.1 J3.5 R6.1)
BLUE: SCH1_MCU (IC1.10), SCH4_RGB_Indicator (IC6.1 R9.2)
BTN: SCH1_MCU (IC1.1), SCH5_Misc (5 pins)
EN: SCH1_MCU (IC1.5), SCH5_Misc (D5.1)
FAN CTRL: SCH1_MCU (IC1.3), SCH3_Fan_Control (IC5.1)
GREEN: SCH1_MCU (IC1.9), SCH4_RGB_Indicator (IC3.2 R10.2)
MONITOR: SCH1_MCU (IC1.14), SCH2_Power (R1.1 R2.2)
NetC7_2: SCH2_Power (IC2.4), SCH5_Misc (C7.2 D5.2 R7.2)
RED: SCH1_MCU (IC1.11), SCH4_RGB_Indicator (IC3.5 R8.2)
RST: SCH1_MCU (IC1.4), SCH5_Misc (J3.3)
SWCLK: SCH1_MCU (IC1.6), SCH5_Misc (J3.2)
SWDIO: SCH1_MCU (IC1.7), SCH5_Misc (J3.1)